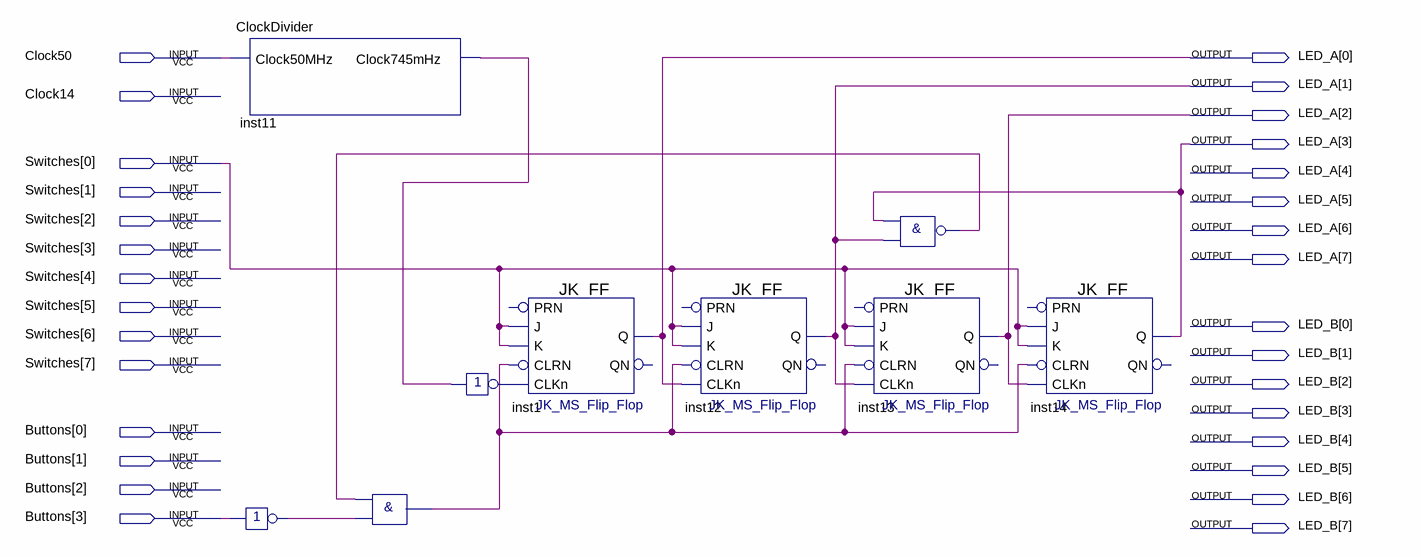
[diagram p0: schematic sheet]
// Quartus schematic AsynchronerDezimalzaehler.bdf as structural Verilog: 9 symbols, 30 pins
module AsynchronerDezimalzaehler (
  input  Clock50,
  input  Clock14,
  input  [7:0] Switches,
  input  [3:0] Buttons,
  output [7:0] LED_A,
  output [7:0] LED_B
);

  wire inst5_out, inst9_out, inst11_clock745mhz, inst15_out, inst16_out;

  ClockDivider inst11 (.Clock50MHz(Clock50), .Clock745mHz(inst11_clock745mhz));
  not inst5 (inst5_out, Buttons[3]);
  and inst16 (inst16_out, inst15_out, inst5_out);
  not inst9 (inst9_out, inst11_clock745mhz);
  JK_FF inst1 (.K(Switches[0]), .J(Switches[0]), .CLRN(inst16_out), .CLKn(inst9_out), .Q(LED_A[0]));  // open: PRN, QN
  JK_FF inst12 (.K(Switches[0]), .J(Switches[0]), .CLRN(inst16_out), .CLKn(LED_A[0]), .Q(LED_A[1]));  // open: PRN, QN
  JK_FF inst13 (.K(Switches[0]), .J(Switches[0]), .CLRN(inst16_out), .CLKn(LED_A[1]), .Q(LED_A[2]));  // open: PRN, QN
  nand inst15 (inst15_out, LED_A[3], LED_A[1]);
  JK_FF inst14 (.K(Switches[0]), .J(Switches[0]), .CLRN(inst16_out), .CLKn(LED_A[2]), .Q(LED_A[3]));  // open: PRN, QN
endmodule
